# Altium schematic sheet Starboard_Headers.SchDoc: Starboard_Headers
size Letter; Author: Nicholas J. Sorensen, and Erik F. Halliwell; Engineer: Nicholas J. Sorensen, and Erik F. HalliwellNicholas Sorensen, and Erik Halliwell; DocumentNumber: 8; SheetNumber: 8; SheetTotal: 8
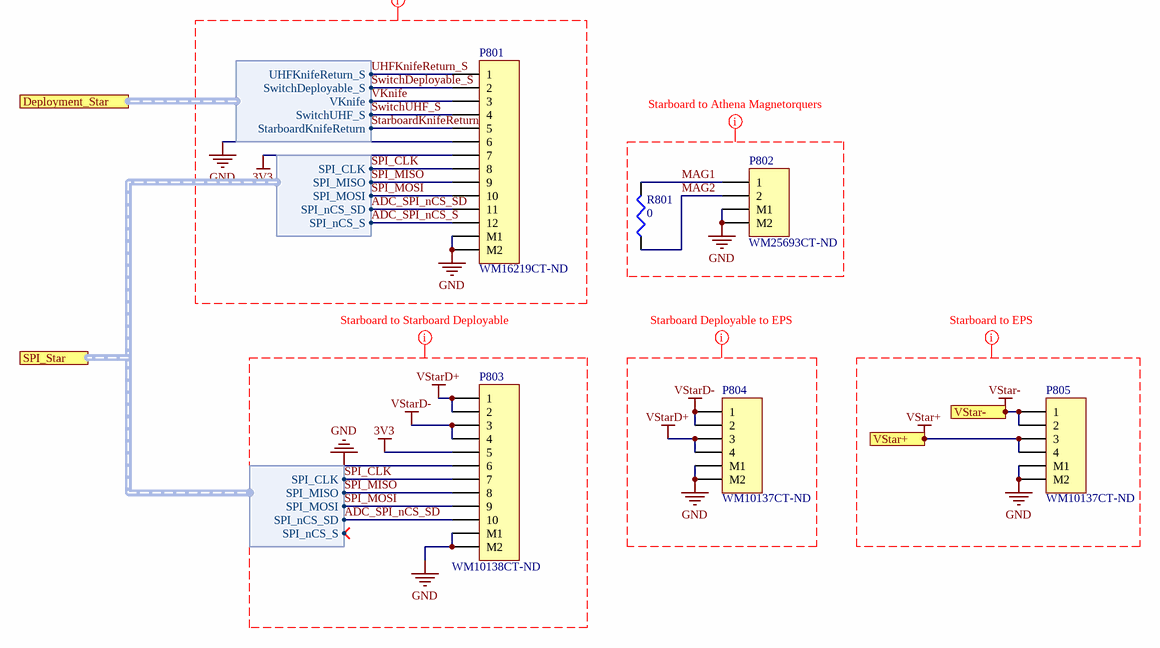
[diagram p0: Starboard_Headers.SchDoc]

## Parts
P801  WM16219CT-ND  [MOLX-5040501291]
P802  WM25693CT-ND  [MOLX-5040500291]
P803  WM10138CT-ND  [MOLX-5040501091]
P804  WM10137CT-ND  [MOLX-5040500491]
P805  WM10137CT-ND  [MOLX-5040500491]
R801  value 0  [VSH-0805MCU]  (hidden comment: Res3)

## Ports
Deployment_Star (harness Deployment_Star), SPI_Star (harness SPI_Star), VStar+, VStar-

## Harnesses
SPI_Star: SPI_MOSI, SPI_MISO, SPI_CLK, SPI_nCS_SD, SPI_nCS_S
Deployment_Star: UHFKnifeReturn_S, SwitchDeployable_S, VKnife, StarboardKnifeReturn, SwitchUHF_S

## Nets
3V3: P801.7 P803.5
GND: P801.6 P801.M1 P801.M2 P802.M1 P802.M2 P803.6 P803.M1 P803.M2 P804.M1 P804.M2 P805.M1 P805.M2
VStar+: P805.3 P805.4 ; port VStar+
VStar-: P805.1 P805.2 ; port VStar-
VStarD+: P803.1 P803.2 P804.3 P804.4
VStarD-: P803.3 P803.4 P804.1 P804.2
ADC_SPI_nCS_S: P801.12 ; port SPI_Star.SPI_nCS_S
ADC_SPI_nCS_SD: P801.11 P803.10 ; port SPI_Star.SPI_nCS_SD
MAG1: P802.1 R801.2
MAG2: P802.2 R801.1
SPI_CLK: P801.8 P803.7 ; port SPI_Star.SPI_CLK
SPI_MISO: P801.9 P803.8 ; port SPI_Star.SPI_MISO
SPI_MOSI: P801.10 P803.9 ; port SPI_Star.SPI_MOSI
StarboardKnifeReturn: P801.5 ; port Deployment_Star.StarboardKnifeReturn
SwitchDeployable_S: P801.2 ; port Deployment_Star.SwitchDeployable_S
SwitchUHF_S: P801.4 ; port Deployment_Star.SwitchUHF_S
UHFKnifeReturn_S: P801.1 ; port Deployment_Star.UHFKnifeReturn_S
VKnife: P801.3 ; port Deployment_Star.VKnife

## Layout directives
mark named Starboard Deployable to EPS: GND, VStarD+, VStarD-
mark named Starboard to EPS: GND, VStar+, VStar-
mark named Starboard to Athena Magnetorquers: GND, MAG1, MAG2
mark named Starboard to Starboard Deployable: 3V3, ADC_SPI_nCS_SD, GND, SPI_CLK, SPI_MISO, SPI_MOSI, VStarD+, VStarD-
mark named Starboard to Athena Burnwires/SPI: 3V3, ADC_SPI_nCS_S, ADC_SPI_nCS_SD, GND, SPI_CLK, SPI_MISO, SPI_MOSI, StarboardKnifeReturn, SwitchDeployable_S, SwitchUHF_S, UHFKnifeReturn_S, VKnife

## Notes on the sheet
- (the "License"); you may not use or redistribute this file except in compliance with the License. You
- This file and the information within it are licensed under the terms of the Apache License, Version 2.0
- Copyright
- Unless required by applicable law or agreed to in writing, content distributed under the License is
- distributed on an "AS IS" BASIS, WITHOUT WARRANTIES OR CONDITIONS OF ANY KIND,
- either express or implied. See the License for the specific language governing permissions and
- limitations under the License.
- may obtain a copy of the License at:
- http://www.apache.org/licenses/LICENSE-2.0
- Title
- Size:
- Date:
- Letter
- Number:
- Time:
- Revision:
- Sheet
- of
- University of Alberta
- Deptartment of Electrical
- and Computer Engineering
- Edmonton AB, Canada
- T6G 1H9
- File:

## Library data of the parts
P801 = 71: CONN HEADER SMD R/A 12POS 1.5MM; Part Number: 71; Manufacturer Part Number: 5040501291; Designator: P?; LatestRevisionDate: 17-Jul-2002; LatestRevisionNote: Re-released for DXP Platform.; Publisher: Altium Limited; Supplier Part Number 1: WM16219CT-ND; Supplier 1: Digi-Key; Supplier Link: #https://www.digikey.ca/product-detail/en/molex/5040501291/WM16219CT-ND/6702294#
P802 = 61: CONN HEADER SMD R/A 2POS 1.5MM; Part Number: 61; Manufacturer Part Number: 5040500291; Designator: P?; LatestRevisionDate: 17-Jul-2002; LatestRevisionNote: Re-released for DXP Platform.; Publisher: Altium Limited; Supplier Part Number 1: WM25693CT-ND; Supplier 1: Digi-Key; Supplier Link: #https://www.digikey.ca/product-detail/en/molex/5040500291/WM25693CT-ND/9954119#
P803 = 69: CONN HEADER SMD R/A 10POS 1.5MM; Part Number: 69; Manufacturer Part Number: 5040501091; Designator: P?; LatestRevisionDate: 17-Jul-2002; LatestRevisionNote: Re-released for DXP Platform.; Publisher: Altium Limited; Supplier Part Number 1: WM10138CT-ND; Supplier 1: Digi-Key; Supplier Link: #https://www.digikey.ca/product-detail/en/molex/5040501091/WM10138CT-ND/4357655#
P804 P805 = 63: CONN HEADER SMD R/A 4POS 1.5MM; Part Number: 63; Manufacturer Part Number: 5040500491; Designator: P?; LatestRevisionDate: 17-Jul-2002; LatestRevisionNote: Re-released for DXP Platform.; Publisher: Altium Limited; Supplier Part Number 1: WM10137CT-ND; Supplier 1: Digi-Key; Supplier Link: #https://www.digikey.ca/product-detail/en/molex/5040500491/WM10137CT-ND/4357653#
R801 = PR-VSH-00003: RES SMD 0.0 OHM JUMPER 1/5W 0805; Manufacturer Part Number: MCU08050Z0000ZP500; Index: 3; Designator: R?; Published: 3/14/2016; LatestRevisionDate: 3/14/2016; LatestRevisionNote: ...; PackageReference: 0805 (2012 Metric); Publisher: AlbertaSat; PackageDescription: Chip Resistor, 2-Leads, Body 2.00x1.25mm, IPC Low Density; Part Number: PR-VSH-00003; Supplier Part Number 1: MCU0805-0.0-ZZCT-ND; Supplier 1: Digi-key; Supplier Link: http://www.digikey.ca/product-search/en?keywords=MCU0805-0.0-ZZCT-ND; Tolerance: Jumper; Power - Rated: 1/5W; Temperature Coefficient: -; Applications: General Purpose